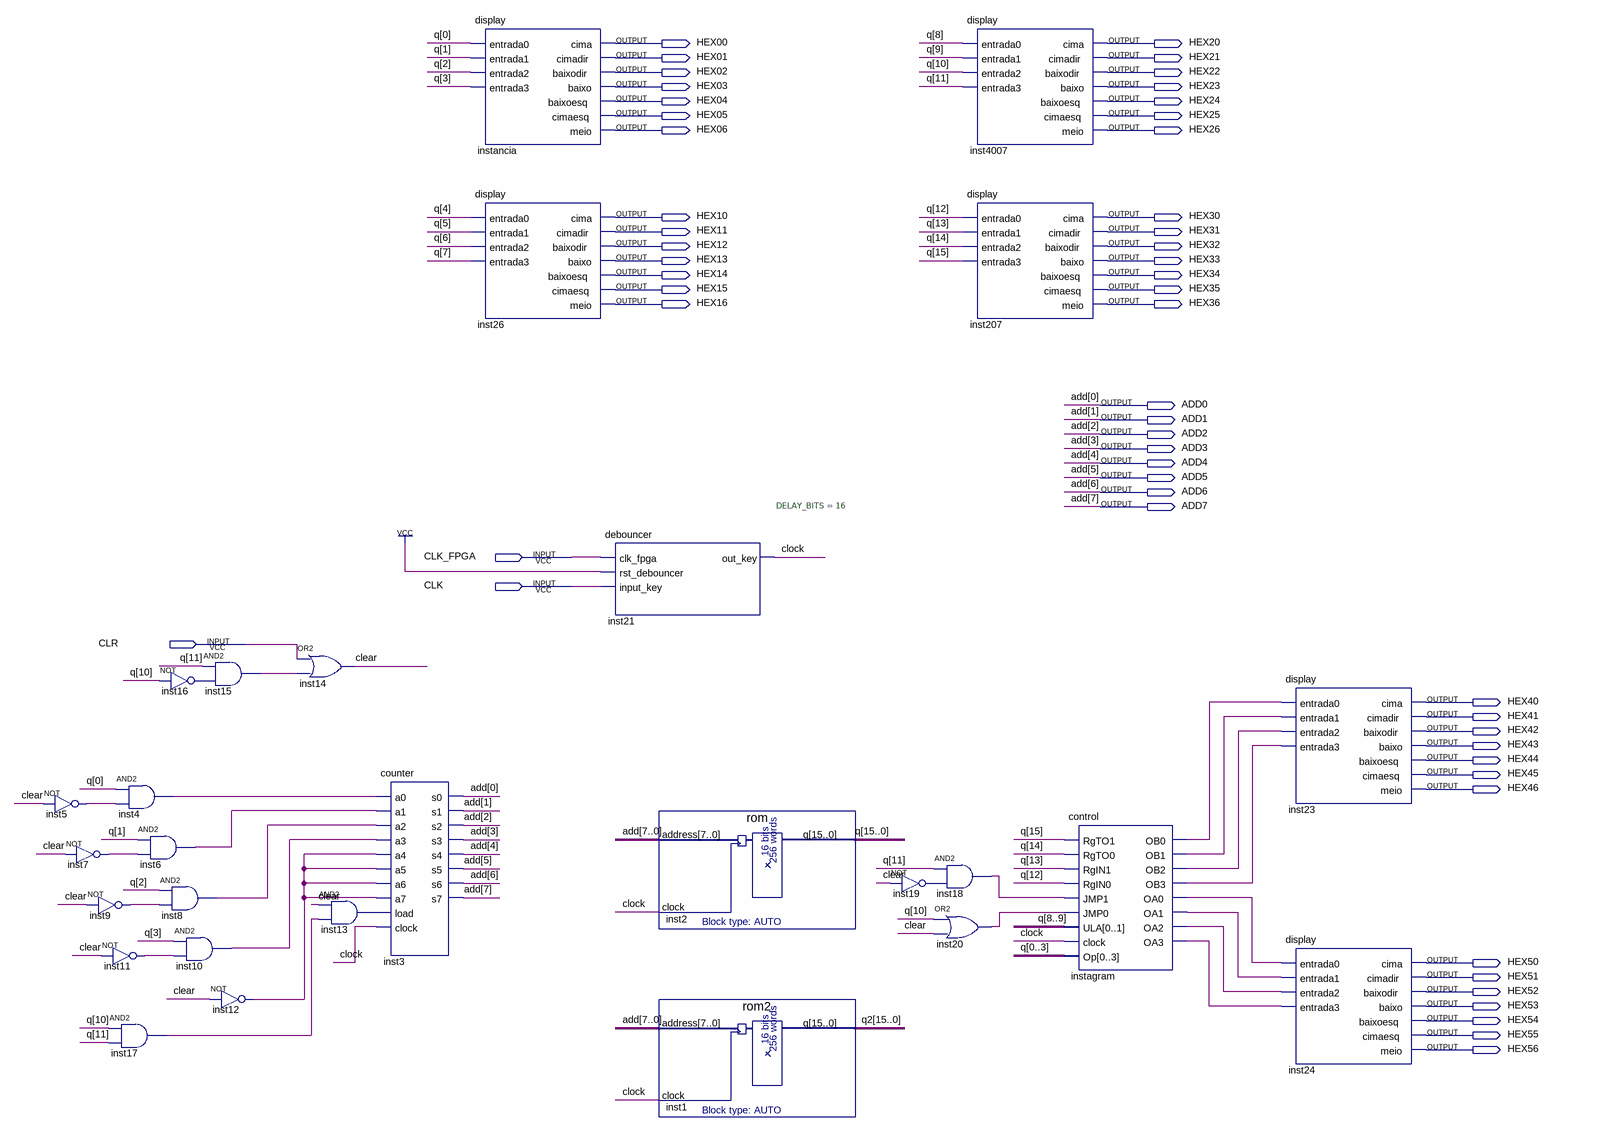
[diagram p0: schematic sheet]
// Quartus schematic cpu_del.bdf as structural Verilog: 28 symbols, 53 pins
module cpu_del (
  input  CLK_FPGA,
  input  CLK,
  input  CLR,
  output HEX00,
  output HEX20,
  output HEX01,
  output HEX21,
  output HEX02,
  output HEX22,
  output HEX03,
  output HEX23,
  output HEX04,
  output HEX24,
  output HEX05,
  output HEX25,
  output HEX06,
  output HEX26,
  output HEX10,
  output HEX30,
  output HEX11,
  output HEX31,
  output HEX12,
  output HEX32,
  output HEX13,
  output HEX33,
  output HEX14,
  output HEX34,
  output HEX15,
  output HEX35,
  output HEX16,
  output HEX36,
  output ADD0,
  output ADD1,
  output ADD2,
  output ADD3,
  output ADD4,
  output ADD5,
  output ADD6,
  output ADD7,
  output HEX40,
  output HEX41,
  output HEX42,
  output HEX43,
  output HEX44,
  output HEX45,
  output HEX46,
  output HEX50,
  output HEX51,
  output HEX52,
  output HEX53,
  output HEX54,
  output HEX55,
  output HEX56
);

  wire clear, clock, inst4_out, inst5_out, inst6_out, inst7_out, inst8_out, inst9_out, inst10_out,
       inst11_out, inst12_out, inst13_out, inst15_out, inst16_out, inst17_out, inst18_out, inst19_out,
       inst20_out, instagram_oa0, instagram_oa1, instagram_oa2, instagram_oa3, instagram_ob0, instagram_ob1,
       instagram_ob2, instagram_ob3;
  wire [15:0] q, q2;

  not inst5 (inst5_out, clear);
  not inst7 (inst7_out, clear);
  not inst9 (inst9_out, clear);
  and inst4 (inst4_out, q[0], inst5_out);
  and inst6 (inst6_out, q[1], inst7_out);
  not inst11 (inst11_out, clear);
  and inst17 (inst17_out, q[10], q[11]);
  and inst15 (inst15_out, q[11], inst16_out);
  not inst16 (inst16_out, q[10]);
  and inst8 (inst8_out, q[2], inst9_out);
  and inst10 (inst10_out, q[3], inst11_out);
  not inst12 (inst12_out, clear);
  or inst14 (clear, CLR, inst15_out);
  and inst13 (inst13_out, clear, inst17_out);
  counter inst3 (
    .a0(inst4_out), .a1(inst6_out), .a2(inst8_out), .a3(inst10_out), .a4(inst12_out), .a5(inst12_out),
    .a6(inst12_out), .a7(inst12_out), .load(inst13_out), .clock(clock), .s0(ADD0), .s1(ADD1), .s2(ADD2),
    .s3(ADD3), .s4(ADD4), .s5(ADD5), .s6(ADD6), .s7(ADD7));
  display instancia (
    .entrada0(q[0]), .entrada1(q[1]), .entrada2(q[2]), .entrada3(q[3]), .cima(HEX00), .cimadir(HEX01),
    .baixodir(HEX02), .baixo(HEX03), .baixoesq(HEX04), .cimaesq(HEX05), .meio(HEX06));
  display inst26 (
    .entrada0(q[4]), .entrada1(q[5]), .entrada2(q[6]), .entrada3(q[7]), .cima(HEX10), .cimadir(HEX11),
    .baixodir(HEX12), .baixo(HEX13), .baixoesq(HEX14), .cimaesq(HEX15), .meio(HEX16));
  debouncer #(.DELAY_BITS(16)) inst21 (.clk_fpga(CLK_FPGA), .rst_debouncer(1'b1), .input_key(CLK), .out_key(clock));
  rom inst2 (.address({ADD7, ADD6, ADD5, ADD4, ADD3, ADD2, ADD1, ADD0}), .clock(clock), .q(q));
  rom2 inst1 (.address({ADD7, ADD6, ADD5, ADD4, ADD3, ADD2, ADD1, ADD0}), .clock(clock), .q(q2));
  not inst19 (inst19_out, clear);
  and inst18 (inst18_out, q[11], inst19_out);
  or inst20 (inst20_out, q[10], clear);
  display inst4007 (
    .entrada0(q[8]), .entrada1(q[9]), .entrada2(q[10]), .entrada3(q[11]), .cima(HEX20), .cimadir(HEX21),
    .baixodir(HEX22), .baixo(HEX23), .baixoesq(HEX24), .cimaesq(HEX25), .meio(HEX26));
  display inst207 (
    .entrada0(q[12]), .entrada1(q[13]), .entrada2(q[14]), .entrada3(q[15]), .cima(HEX30), .cimadir(HEX31),
    .baixodir(HEX32), .baixo(HEX33), .baixoesq(HEX34), .cimaesq(HEX35), .meio(HEX36));
  control instagram (
    .RgTO1(q[15]), .RgTO0(q[14]), .RgIN1(q[13]), .RgIN0(q[12]), .JMP1(inst18_out), .JMP0(inst20_out),
    .ULA({q[8], q[9]}), .clock(clock), .Op({q[0], q[1], q[2], q[3]}), .OB0(instagram_ob0),
    .OB1(instagram_ob1), .OB2(instagram_ob2), .OB3(instagram_ob3), .OA0(instagram_oa0), .OA1(instagram_oa1),
    .OA2(instagram_oa2), .OA3(instagram_oa3));
  display inst23 (
    .entrada0(instagram_ob0), .entrada1(instagram_ob1), .entrada2(instagram_ob2), .entrada3(instagram_ob3),
    .cima(HEX40), .cimadir(HEX41), .baixodir(HEX42), .baixo(HEX43), .baixoesq(HEX44), .cimaesq(HEX45),
    .meio(HEX46));
  display inst24 (
    .entrada0(instagram_oa0), .entrada1(instagram_oa1), .entrada2(instagram_oa2), .entrada3(instagram_oa3),
    .cima(HEX50), .cimadir(HEX51), .baixodir(HEX52), .baixo(HEX53), .baixoesq(HEX54), .cimaesq(HEX55),
    .meio(HEX56));
endmodule
